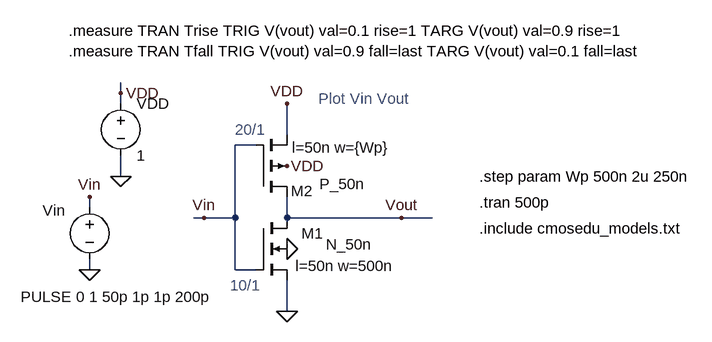
[diagram p0: schematic Fig11_11_varying_Wp.asc]
Fig11_11_varying_Wp.asc, the LTspice schematic file:
Version 4
SHEET 1 1156 680
WIRE 192 -368 192 -384
WIRE 192 -352 192 -368
WIRE 448 -304 448 -352
WIRE 400 -288 368 -288
WIRE 192 -240 192 -272
WIRE 144 -192 144 -208
WIRE 320 -176 304 -176
WIRE 368 -176 368 -288
WIRE 368 -176 320 -176
WIRE 448 -176 448 -208
WIRE 624 -176 448 -176
WIRE 672 -176 624 -176
WIRE 144 -96 144 -112
WIRE 368 -96 368 -176
WIRE 400 -96 368 -96
WIRE 448 -32 448 -80
FLAG 144 -96 0
FLAG 624 -176 Vout
FLAG 144 -208 Vin
FLAG 448 -128 0
FLAG 192 -240 0
FLAG 192 -368 VDD
FLAG 448 -256 VDD
FLAG 448 -32 0
FLAG 448 -352 VDD
FLAG 320 -176 Vin
SYMBOL nmos4 400 -176 R0
WINDOW 0 104 24 Right 2
WINDOW 3 179 41 Right 2
WINDOW 123 213 74 Right 2
SYMATTR InstName M1
SYMATTR Value N_50n
SYMATTR Value2 l=50n w=500n
SYMBOL voltage 144 -208 R0
WINDOW 0 -72 21 Left 2
WINDOW 3 -106 154 Left 2
WINDOW 123 0 0 Left 2
WINDOW 39 0 0 Left 2
SYMATTR InstName Vin
SYMATTR Value PULSE 0 1 50p 1p 1p 200p
SYMBOL voltage 192 -368 R0
WINDOW 123 0 0 Left 2
WINDOW 39 0 0 Left 2
SYMATTR InstName VDD
SYMATTR Value 1
SYMBOL pmos4 400 -208 M180
WINDOW 0 88 9 Right 2
WINDOW 3 168 20 Right 2
WINDOW 123 206 76 Right 2
SYMATTR InstName M2
SYMATTR Value P_50n
SYMATTR Value2 l=50n w={Wp}
TEXT 744 -200 Left 2 !.tran 500p
TEXT 744 -160 Left 2 !.include cmosedu_models.txt
TEXT 496 -360 Left 2 ;Plot Vin Vout
TEXT 368 -312 Left 2 ;20/1
TEXT 360 -72 Left 2 ;10/1
TEXT 744 -240 Left 2 !.step param Wp 500n 2u 250n
TEXT 112 -464 Left 2 !.measure TRAN Trise TRIG V(vout) val=0.1 rise=1 TARG V(vout) val=0.9 rise=1\n.measure TRAN Tfall TRIG V(vout) val=0.9 fall=last TARG V(vout) val=0.1 fall=last

The netlist it stands for:
* Fig11_11_varying_Wp.asc
M1 Vout Vin 0 0 N_50n l=50n w=500n
Vin Vin 0 PULSE 0 1 50p 1p 1p 200p
VDD VDD 0 1
M2 Vout Vin VDD VDD P_50n l=50n w={Wp}
.model NMOS NMOS
.model PMOS PMOS
.lib standard.mos
.tran 500p
.include cmosedu_models.txt
* Plot Vin Vout
* 20/1
* 10/1
.step param Wp 500n 2u 250n
.measure TRAN Trise TRIG V(vout) val=0.1 rise=1 TARG V(vout) val=0.9 rise=1
.measure TRAN Tfall TRIG V(vout) val=0.9 fall=last TARG V(vout) val=0.1 fall=last
.backanno
.end